# EAGLE design eCog001_Proto_PTH (EAGLE 6.6.0)
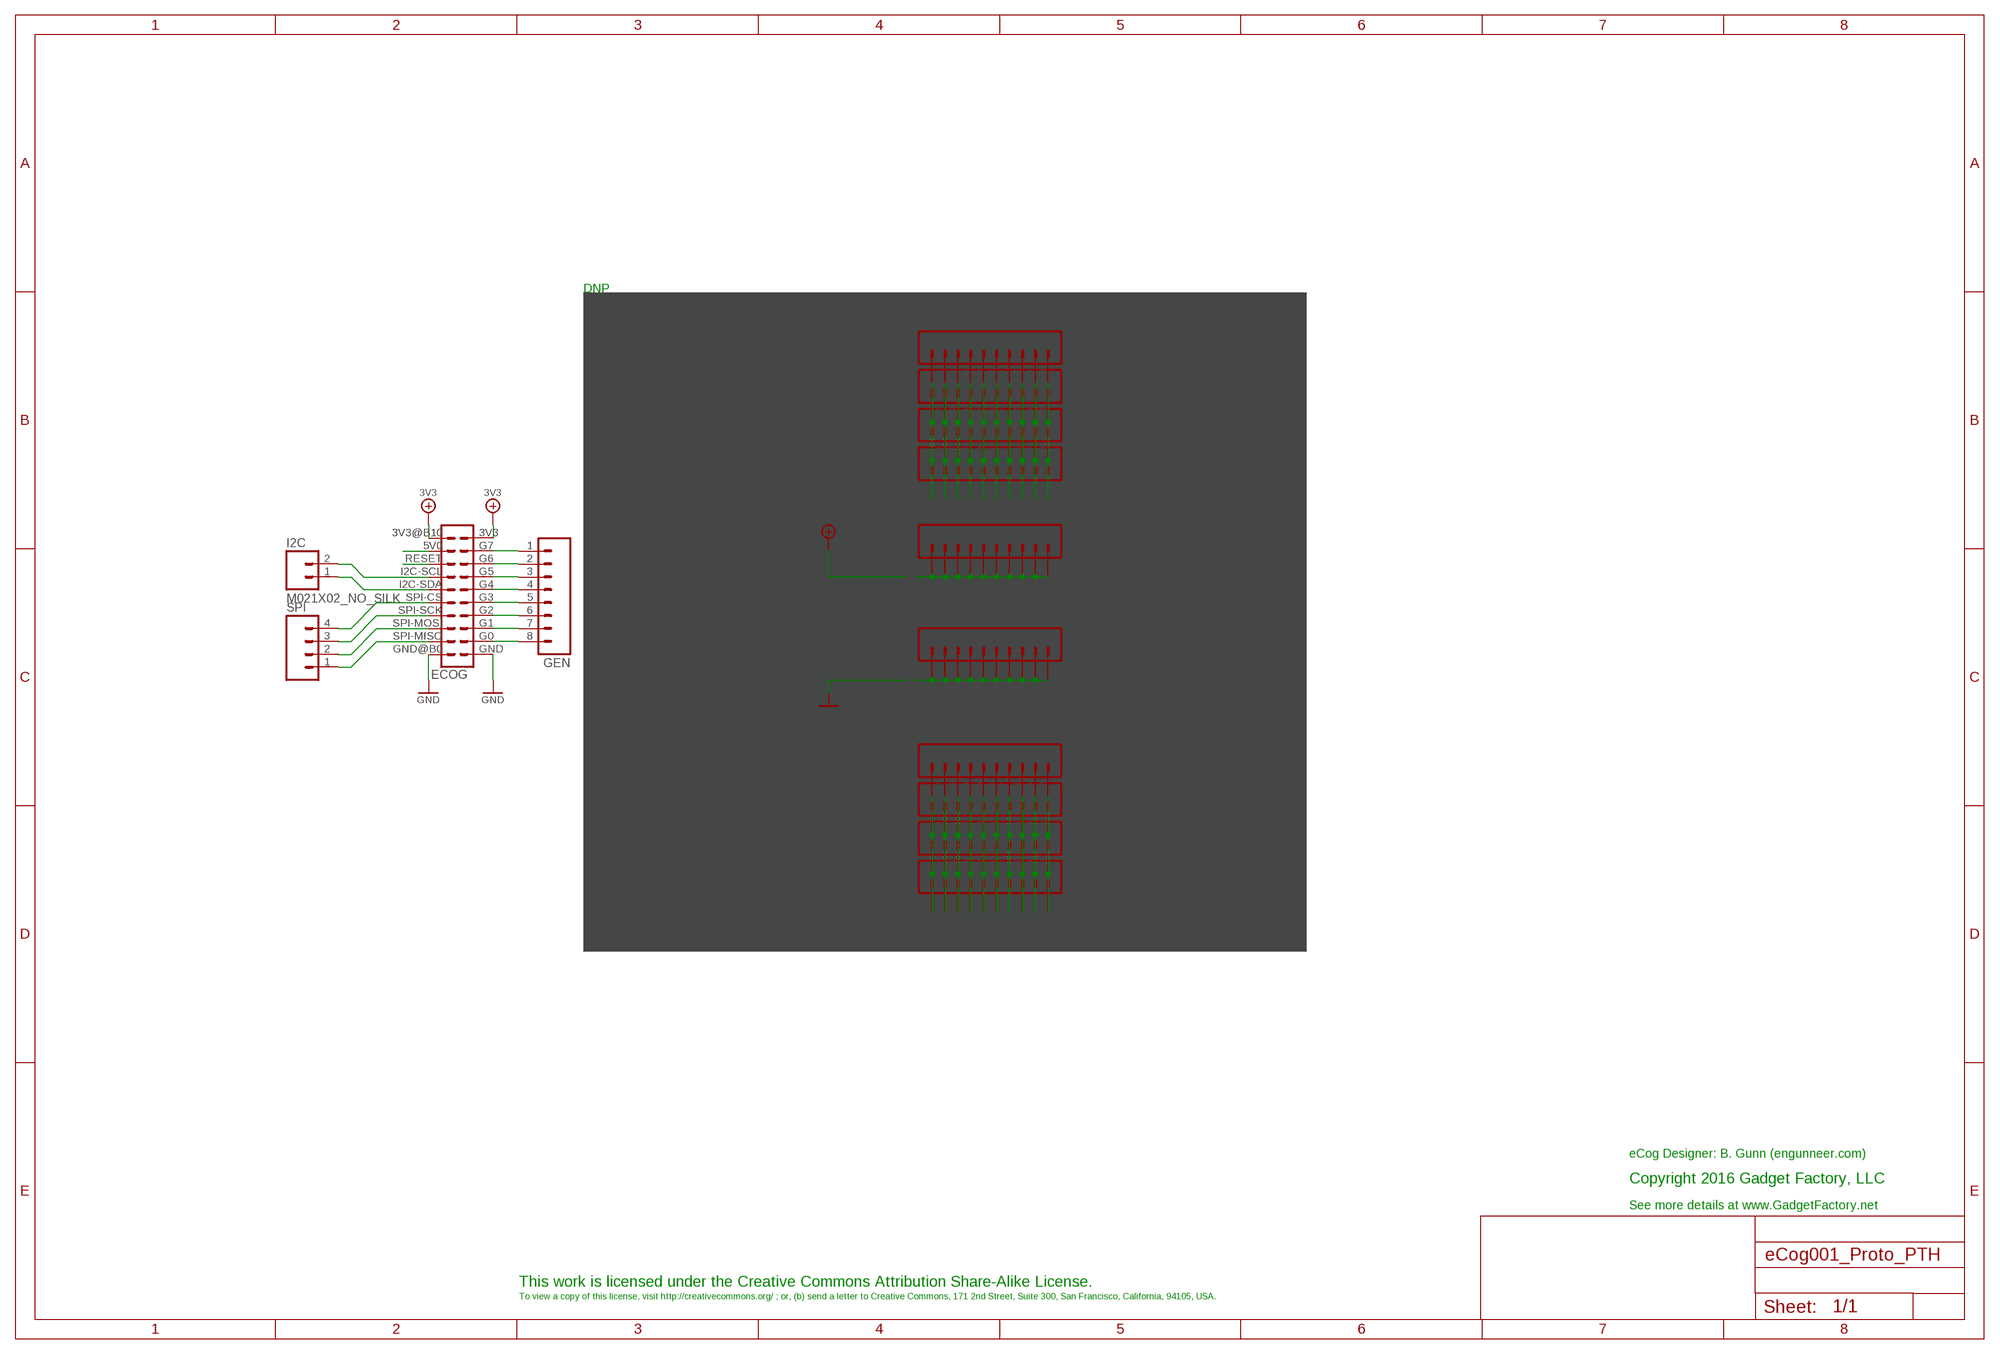
[diagram p0: schematic, sheet 1]

## Parts
ECOG  ECOG_DUALTHROUGHHOLE  [ECOG_DUAL_TH]
GEN  M08NO_SILK  [1X08_NO_SILK]
GND  M10NO_SILK  [1X10_NO_SILK]
I2C  M021X02_NO_SILK  [1X02_NO_SILK]
P1  M10NO_SILK  [1X10_NO_SILK]
P2  M10NO_SILK  [1X10_NO_SILK]
P3  M10NO_SILK  [1X10_NO_SILK]
P4  M10NO_SILK  [1X10_NO_SILK]
P5  M10NO_SILK  [1X10_NO_SILK]
P6  M10NO_SILK  [1X10_NO_SILK]
P7  M10NO_SILK  [1X10_NO_SILK]
P8  M10NO_SILK  [1X10_NO_SILK]
SPI  M041X04_NO_SILK  [1X04_NO_SILK]
VCC  M10NO_SILK  [1X10_NO_SILK]

## Nets
3V3: ECOG.3V3 ECOG.3V3@B10(3V3) VCC.1 VCC.2 VCC.3 VCC.4 VCC.5 VCC.6 VCC.7 VCC.8 VCC.9 VCC.10
GND: ECOG.GND ECOG.GND@B0(GND) GND.1 GND.2 GND.3 GND.4 GND.5 GND.6 GND.7 GND.8 GND.9 GND.10
N$1: ECOG.G7 GEN.1
N$2: ECOG.G6 GEN.2
N$3: ECOG.G5 GEN.3
N$4: ECOG.G4 GEN.4
N$5: ECOG.G3 GEN.5
N$6: ECOG.G2 GEN.6
N$7: ECOG.G1 GEN.7
N$8: ECOG.G0 GEN.8
N$9: ECOG.SPI-MISO SPI.1
N$10: ECOG.SPI-MOSI SPI.2
N$11: ECOG.SPI-SCK SPI.3
N$12: ECOG.SPI-CS SPI.4
N$13: ECOG.I2C-SDA I2C.1
N$14: ECOG.I2C-SCL I2C.2
N$15: ECOG.RESET
N$16: ECOG.5V0(5V)
N$18: P1.2 P2.2 P3.2 P4.2
N$19: P1.3 P2.3 P3.3 P4.3
N$20: P1.4 P2.4 P3.4 P4.4
N$21: P1.5 P2.5 P3.5 P4.5
N$22: P1.6 P2.6 P3.6 P4.6
N$23: P1.7 P2.7 P3.7 P4.7
N$24: P1.8 P2.8 P3.8 P4.8
N$25: P1.9 P2.9 P3.9 P4.9
N$26: P1.10 P2.10 P3.10 P4.10
N$27: P1.1 P2.1 P3.1 P4.1
N$37: P5.1 P6.1 P7.1 P8.1
N$38: P5.2 P6.2 P7.2 P8.2
N$39: P5.3 P6.3 P7.3 P8.3
N$40: P5.4 P6.4 P7.4 P8.4
N$41: P5.5 P6.5 P7.5 P8.5
N$42: P5.6 P6.6 P7.6 P8.6
N$43: P5.7 P6.7 P7.7 P8.7
N$44: P5.8 P6.8 P7.8 P8.8
N$45: P5.9 P6.9 P7.9 P8.9
N$46: P5.10 P6.10 P7.10 P8.10

## Notes on the sheet
- DNP
- eCog Designer: B. Gunn (engunneer.com)
- Copyright 2016 Gadget Factory, LLC
- See more details at www.GadgetFactory.net
- This work is licensed under the Creative Commons Attribution Share-Alike License.
- To view a copy of this license, visit http://creativecommons.org/ ; or, (b) send a letter to Creative Commons, 171 2nd Street, Suite 300, San Francisco, California, 94105, USA.

## Library data of the parts
ECOG = eCogs:ECOG_DUAL
GEN = SparkFun-Connectors:M08: Header 8 Standard 8-pin 0.1" header. Use with straight break away headers (SKU : PRT-00116), right angle break away headers (PRT-00553), swiss pins (PRT-00743), machine pins (PRT-00117), and female headers (PRT-00115).
GND P1-P8 VCC = SparkFun-Connectors:M10: Header 10 Standard 10-pin 0.1" header. Use with straight break away headers (SKU : PRT-00116), right angle break away headers (PRT-00553), swiss pins (PRT-00743), machine pins (PRT-00117), and female headers (PRT-00115).
I2C = SparkFun-Connectors:M02: Standard 2-pin 0.1" header. Use with - straight break away headers ( PRT-00116) - right angle break away headers (PRT-00553) - swiss pins (PRT-00743) - machine pins (PRT-00117) - female headers (PRT-00115) Molex polarized connector foot print use with: PRT-08233 with associated crimp pins and housings. 2.54_SCREWTERM for use with PRT-10571. 3.5mm Screw Terminal footprints for PRT-08084 5mm Screw Terminal footprints for use with PRT-08433
SPI = SparkFun-Connectors:M04: Header 4 Standard 4-pin 0.1" header. Use with straight break away headers (SKU : PRT-00116), right angle break away headers (PRT-00553), swiss pins (PRT-00743), machine pins (PRT-00117), and female headers (PRT-00115). Molex polarized connector foot print use with SKU : PRT-08231 with associated crimp pins and housings. 1MM SMD Version SKU: PRT-10208

## Board
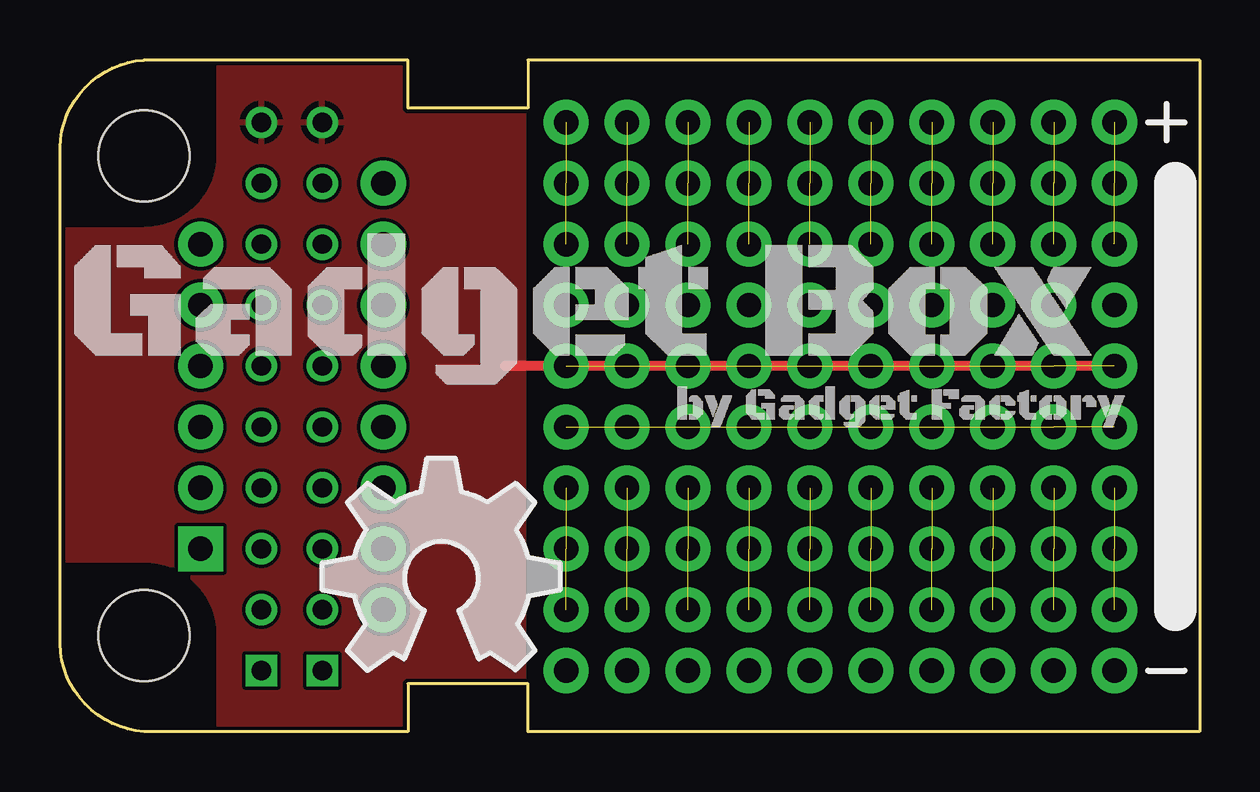
[diagram p1: board, top side]
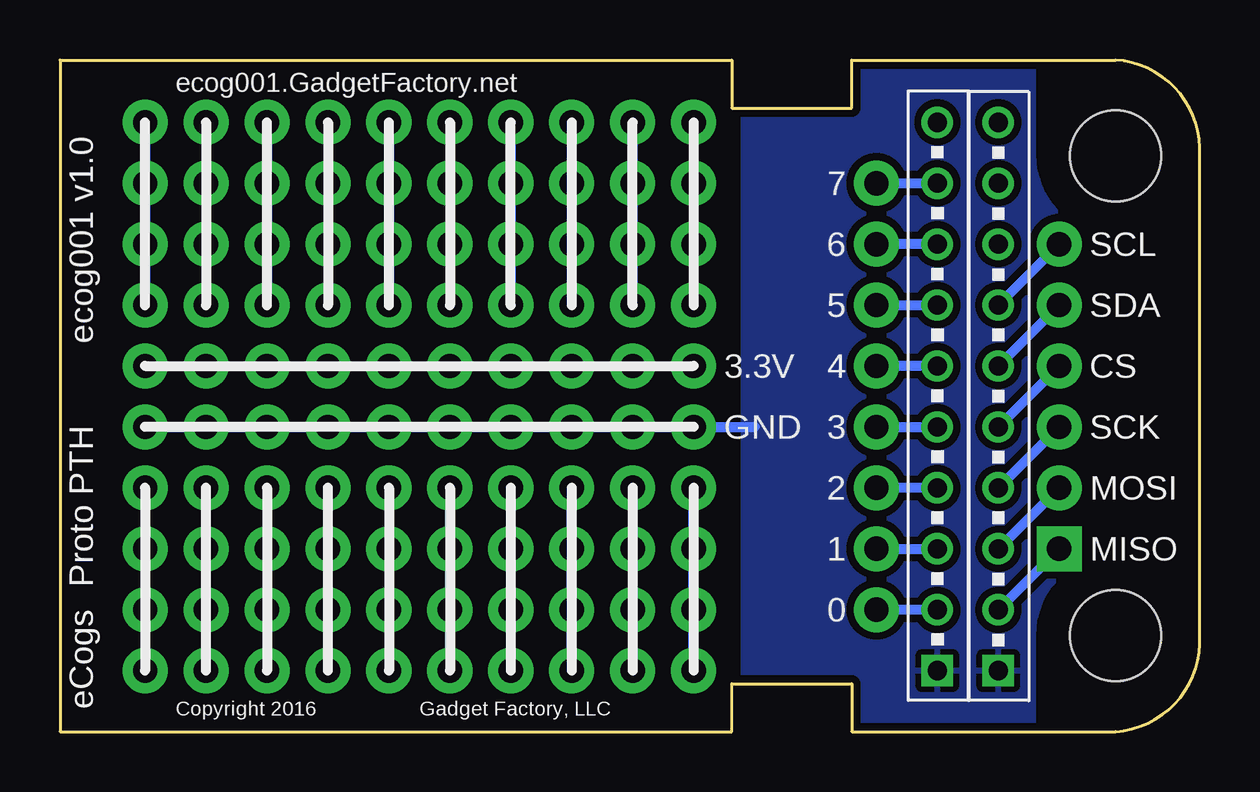
[diagram p2: board, bottom side, seen from below]

Size 47.51 x 28 mm. Coordinates in mm from the lower left corner, seen from the top.
Copper layers (1*16): Top 0.035mm / dielectric 1.5mm / Bottom 0.035mm
Design rules "hackvana *": minimum track width 6mil, minimum drill 0.3mm, track to track 6mil, track to pad 6mil, pad to pad 6mil, via to via 6mil, smd to smd 0mil, copper to edge 6mil, drill to drill 6mil, minimum pad ring 10mil, minimum via ring 6mil, stop-mask expansion 2mil, vias tented up to drill 100mil, thermal gap 10mil

### Footprints (pad centres in the part's own frame; a part is rotated, then mirrored left to right if it is on the bottom)
ECOG_DUAL_TH = drill 0.8: 3V3 11.43,25.4; 3V3@B10 8.89,25.4; 5V0 8.89,22.86; G0 11.43,5.08; G1 11.43,7.62; G2 11.43,10.16; G3 11.43,12.7; G4 11.43,15.24; G5 11.43,17.78; G6 11.43,20.32; G7 11.43,22.86; I2C-SCL 8.89,17.78; I2C-SDA 8.89,15.24; RESET 8.89,20.32; SPI-CS 8.89,12.7; SPI-MISO 8.89,5.08; SPI-MOSI 8.89,7.62; SPI-SCK 8.89,10.16 | drill 0.8 square: GND 11.43,2.54; GND@B0 8.89,2.54 | hole 3.8: 4,24; 4,4
1X08_NO_SILK = drill 1.016 pad 1.88: 1 0,0; 2 2.54,0; 3 5.08,0; 4 7.62,0; 5 10.16,0; 6 12.7,0; 7 15.24,0; 8 17.78,0
1X10_NO_SILK = drill 1.016 pad 1.88: 1 0,0; 2 2.54,0; 3 5.08,0; 4 7.62,0; 5 10.16,0; 6 12.7,0; 7 15.24,0; 8 17.78,0; 9 20.32,0; 10 22.86,0
1X02_NO_SILK = drill 1.016 pad 1.88: 1 0,0; 2 2.54,0
1X04_NO_SILK = drill 1.016 pad 1.88 square: 1 0,0 | drill 1.016 pad 1.88: 2 2.54,0; 3 5.08,0; 4 7.62,0

### Placement (x,y rotation side)
ECOG  -0.49,0 0 top
GEN  13.48,22.86 270 top
GND  21.1,12.7 0 top
I2C  5.86,17.78 90 bottom
P1  21.1,25.4 0 top
P2  21.1,22.86 0 top
P3  21.1,20.32 0 top
P4  21.1,17.78 0 top
P5  21.1,10.16 0 top
P6  21.1,7.62 0 top
P7  21.1,5.08 0 top
P8  21.1,2.54 0 top
SPI  5.86,7.62 90 bottom
U$1  [GADGETBOX_TEXT]  21.86,17.4 0 top
U$10  [OSHW_FILLX350_NOTEXT]  10.94,2.54 0 top
VCC  21.1,15.24 0 top

### Tracks (layer width: path | path; a pad name or v marks a point on that pad's centre or on a via)
3V3  (9 unrouted)
  Top 0.406: VCC.10 18.56,15.24
  pour Top: -1.49,29 19.3,29 19.3,-1 -1.49,-1
GND  (9 unrouted)
  Bottom 0.406: GND.10 18.56,12.7
  pour Bottom (isolate 0.305): -2.49,30 19.03,30 19.03,-2 -2.49,-2
N$1
  Bottom 0.406: GEN.1 ECOG.G7
N$2
  Bottom 0.406: ECOG.G6 GEN.2
N$3
  Bottom 0.406: GEN.3 ECOG.G5
N$4
  Bottom 0.406: ECOG.G4 GEN.4
N$5
  Bottom 0.406: GEN.5 ECOG.G3
N$6
  Bottom 0.406: ECOG.G2 GEN.6
N$7
  Bottom 0.406: GEN.7 ECOG.G1
N$8
  Bottom 0.406: ECOG.G0 GEN.8
N$9
  Bottom 0.406: SPI.1 ECOG.SPI-MISO
N$10
  Bottom 0.406: SPI.2 ECOG.SPI-MOSI
N$11
  Bottom 0.406: SPI.3 ECOG.SPI-SCK
N$12
  Bottom 0.406: SPI.4 ECOG.SPI-CS
N$13
  Bottom 0.406: I2C.1 ECOG.I2C-SDA
N$14
  Bottom 0.406: I2C.2 ECOG.I2C-SCL
N$18  (2 unrouted)
  Bottom 0.406: P1.2 P4.2
N$19  (2 unrouted)
  Bottom 0.406: P1.3 P4.3
N$20  (2 unrouted)
  Bottom 0.406: P1.4 P4.4
N$21  (2 unrouted)
  Bottom 0.406: P1.5 P4.5
N$22  (2 unrouted)
  Bottom 0.406: P1.6 P4.6
N$23  (2 unrouted)
  Bottom 0.406: P1.7 P4.7
N$24  (2 unrouted)
  Bottom 0.406: P1.8 P4.8
N$25  (2 unrouted)
  Bottom 0.406: P1.9 P4.9
N$26  (2 unrouted)
  Bottom 0.406: P1.10 P4.10
N$27  (2 unrouted)
  Bottom 0.406: P1.1 P4.1
N$37  (2 unrouted)
  Bottom 0.406: P8.1 P5.1
N$38  (2 unrouted)
  Bottom 0.406: P5.2 P8.2
N$39  (2 unrouted)
  Bottom 0.406: P8.3 P5.3
N$40  (2 unrouted)
  Bottom 0.406: P5.4 P8.4
N$41  (2 unrouted)
  Bottom 0.406: P8.5 P5.5
N$42  (2 unrouted)
  Bottom 0.406: P5.6 P8.6
N$43  (2 unrouted)
  Bottom 0.406: P8.7 P5.7
N$44  (2 unrouted)
  Bottom 0.406: P5.8 P8.8
N$45  (2 unrouted)
  Bottom 0.406: P8.9 P5.9
N$46  (2 unrouted)
  Bottom 0.406: P5.10 P8.10

### Text on the board
bPlace: ecog001.GadgetFactory.net | 7 | SCL | 6 | SDA | 5 | ecog001 v1.0 | CS | 4 | 3.3V | SCK | 3 | GND | MOSI | 2 | MISO | 1 | Proto PTH | 0 | Gadget Factory, LLC | Copyright 2016 | eCogs